# EAGLE design ESP32 UWB v1.0 (EAGLE 6.1)
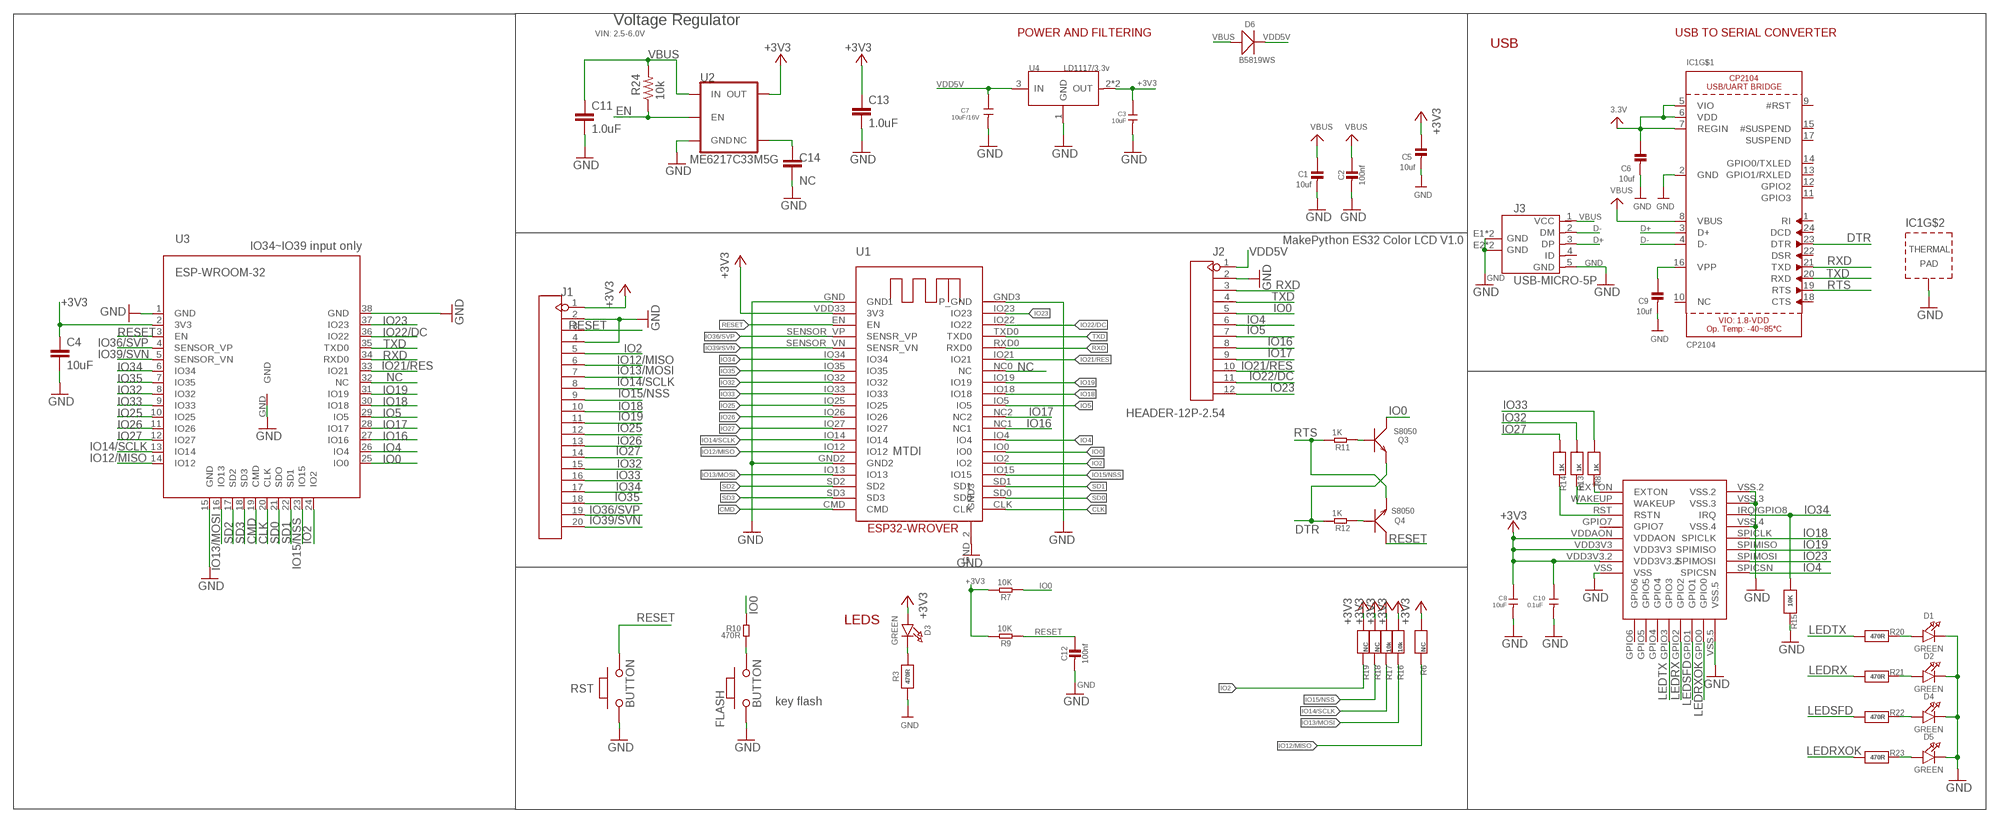
[diagram p0: schematic, sheet 1]

## Parts
C1  10uf  CAP_CERAMIC0603_NO  [0603-NO]
C2  100nf  CAP_CERAMIC0603_NO  [0603-NO]
C3  10uF  C-0603  [C0603]
C4  10uF  C-EUC0603  [C0603]
C5  10uf  CAP_CERAMIC0603_NO  [0603-NO]
C6  10uf  CAP_CERAMIC0603_NO  [0603-NO]
C7  10uF/16V  C-0603  [C0603]
C8  10uF  C-0603  [C0603]
C9  10uf  CAP_CERAMIC0603_NO  [0603-NO]
C10  0.1uF  C-0603  [C0603]
C11  1.0uF  1.0UF-0603-16V-10%  [0603]
C12  100nf  CAP_CERAMIC0603_NO  [0603-NO]
C13  1.0uF  1.0UF-0603-16V-10%  [0603]
C14  NC  1.0UF-0603-16V-10%  [0603]
D1  GREEN  LED0805_NOOUTLINE  [CHIPLED_0805_NOOUTLINE]
D2  GREEN  LED0805_NOOUTLINE  [CHIPLED_0805_NOOUTLINE]
D3  GREEN  LED0805_NOOUTLINE  [CHIPLED_0805_NOOUTLINE]
D4  GREEN  LED0805_NOOUTLINE  [CHIPLED_0805_NOOUTLINE]
D5  GREEN  LED0805_NOOUTLINE  [CHIPLED_0805_NOOUTLINE]
D6  B5819WS  D'0805'  [SOD323]
FLASH  BUTTON  PB157  [157SW]
IC1  CP2104  [QFN24_4MM_SMSC]
J1  HEADER-20P-2.54  [20P-2.54]
J2  HEADER-12P-2.54  [12P-2.54]
J3  USB-MICRO-5P  [MICRO-USB-5P]
Q3  S8050  TRANSISTOR-NPN-SOT23  [SOT23]
Q4  S8050  TRANSISTOR-NPN-SOT23  [SOT23]
R3  470R  RESISTOR_0603_NOOUT  [0603-NO]
R6  NC  RESISTOR_0603_NOOUT  [0603-NO]
R7  10K  R-0603  [0603]
R8  1K  RESISTOR_0603_NOOUT  [0603-NO]
R9  10K  R-0603  [0603]
R10  470R  R-0603  [0603]
R11  1K  R-0603  [0603]
R12  1K  R-0603  [0603]
R13  1K  RESISTOR_0603_NOOUT  [0603-NO]
R14  1K  RESISTOR_0603_NOOUT  [0603-NO]
R15  10K  RESISTOR_0603_NOOUT  [0603-NO]
R16  10k  RESISTOR_0603_NOOUT  [0603-NO]
R17  10k  RESISTOR_0603_NOOUT  [0603-NO]
R18  NC  RESISTOR_0603_NOOUT  [0603-NO]
R19  NC  RESISTOR_0603_NOOUT  [0603-NO]
R20  470R  RESISTOR_0603_NOOUT  [0603-NO]
R21  470R  RESISTOR_0603_NOOUT  [0603-NO]
R22  470R  RESISTOR_0603_NOOUT  [0603-NO]
R23  470R  RESISTOR_0603_NOOUT  [0603-NO]
R24  10k  10KOHM-0603-1/10W-1%  [0603]
RST  BUTTON  PB157  [157SW]
U1  ESP32-WROVER  [ESP32-WROVER]
U2  ME6217C33M5G  V_REG_AP2112K-3.3V  [SOT23-5]
U3  ESP-WROOM-32  [ESP-WROOM-32]
U4  LD1117/3.3v  LD1117'SOT89'  [SOT89]
U5  DWM1000  [DWM1000]

## Nets
+3V3: C3.1 C4.1 C5.1 C6.1 C8.1 C10.1 C13.1 D3.A IC1.5(VIO) IC1.6(VDD) IC1.7(REGIN) J1.1 R6.1 R7.2 R9.2 R16.1 R17.1 R18.1 R19.1 U1.VDD33(3V3) U2.5(OUT) U3.2(3V3) U4.2(OUT) U4.4(OUT) U5.VDD3V3 U5.VDD3V3.2 U5.VDDAON ; supply symbol labelled 3.3V
CLK: U1.CLK U3.20(CLK)
CMD: U1.CMD U3.19(CMD)
D+: IC1.3(D+) J3.3(DP)
D-: IC1.4(D-) J3.2(DM)
DTR: IC1.23(DTR) Q3.2(E) R12.2
EN: R24.1 U2.3(EN)
GND: C1.2 C2.2 C3.2 C4.2 C5.2 C6.2 C7.2 C8.2 C9.2 C10.2 C11.2 C12.2 C13.2 C14.2 D1.C D2.C D4.C D5.C FLASH.1 IC1.2(GND) IC1.THERM(TP) J1.2 J1.4 J2.2 J3.5(GND) J3.E1(GND) J3.E2(GND) J3.P1(GND) J3.P2(GND) R3.1 R15.2 RST.1 U1.GND2 U1.GND3(P_GND) U1.GND(GND1) U1.GND_2(GND3) U2.2(GND) U3.1(GND) U3.15(GND) U3.38(GND) U3.GND U4.1(GND) U5.VSS U5.VSS.2 U5.VSS.3 U5.VSS.4 U5.VSS.5
IO0: J2.5 Q3.3(C) R7.1 R10.2 U1.IO0 U3.25(IO0)
IO2: J1.5 R19.2 U1.IO2 U3.24(IO2)
IO4: J2.6 U1.IO4 U3.26(IO4) U5.SPICSN
IO5: J2.7 U1.IO5 U3.29(IO5)
IO12/MISO: J1.6 R6.2 U1.IO12 U3.14(IO12)
IO13/MOSI: J1.7 R16.2 U1.IO13 U3.16(IO13)
IO14/SCLK: J1.8 R17.2 U1.IO14 U3.13(IO14)
IO15/NSS: J1.9 R18.2 U1.IO15 U3.23(IO15)
IO16: J2.8 U1.NC1 U3.27(IO16)
IO17: J2.9 U1.NC2 U3.28(IO17)
IO18: J1.10 U1.IO18 U3.30(IO18) U5.SPICLK
IO19: J1.11 U1.IO19 U3.31(IO19) U5.SPIMISO
IO21/RES: J2.10 U1.IO21 U3.33(IO21)
IO22/DC: J2.11 U1.IO22 U3.36(IO22)
IO23: J2.12 U1.IO23 U3.37(IO23) U5.SPIMOSI
IO25: J1.12 U1.IO25 U3.10(IO25)
IO26: J1.13 U1.IO26 U3.11(IO26)
IO27: J1.14 R14.1 U1.IO27 U3.12(IO27)
IO32: J1.15 R13.1 U1.IO32 U3.8(IO32)
IO33: J1.16 R8.1 U1.IO33 U3.9(IO33)
IO34: J1.17 R15.1 U1.IO34 U3.6(IO34) U5.IRQ/GPIO8(IRQ)
IO35: J1.18 U1.IO35 U3.7(IO35)
IO36/SVP: J1.19 U1.SENSOR_VP(SENSR_VP) U3.4(SENSOR_VP)
IO39/SVN: J1.20 U1.SENSOR_VN(SENSR_VN) U3.5(SENSOR_VN)
LEDRX: R21.1 U5.GPIO2
LEDRXOK: R23.1 U5.GPIO0
LEDSFD: R22.1 U5.GPIO1
LEDTX: R20.1 U5.GPIO3
N$1: D1.A R20.2
N$2: C9.1 IC1.16(VPP)
N$3: C14.1 U2.4(NC)
N$5: D3.C R3.2
N$10: R8.2 U5.EXTON
N$11: R13.2 U5.WAKEUP
N$12: R14.2 U5.RST(RSTN)
N$13: Q4.1(B) R12.1
N$14: Q3.1(B) R11.1
N$15: FLASH.2 R10.1
N$16: D2.A R21.2
N$17: D4.A R22.2
N$18: D5.A R23.2
NC: U1.NC0(NC) U3.32(NC)
RESET: C12.1 J1.3 Q4.3(C) R9.1 RST.2 U1.EN U3.3(EN)
RTS: IC1.19(RTS) Q4.2(E) R11.2
RXD: IC1.21(TXD) J2.3 U1.RXD0 U3.34(RXD0)
SD0: U1.SD0 U3.21(SDO)
SD1: U1.SD1 U3.22(SD1)
SD2: U1.SD2 U3.17(SD2)
SD3: U1.SD3 U3.18(SD3)
TXD: IC1.20(RXD) J2.4 U1.TXD0 U3.35(TXD0)
VBUS: C1.1 C2.1 C11.1 D6.+ IC1.8(VBUS) J3.1(VCC) R24.2 U2.1(IN)
VDD5V: C7.1 D6.- J2.1 U4.3(IN)
Unconnected: IC1.1(RI) IC1.9(#RST) IC1.10(NC) IC1.11(GPIO3) IC1.12(GPIO2) IC1.13(GPIO1/RXLED) IC1.14(GPIO0/TXLED) IC1.15(#SUSPEND) IC1.17(SUSPEND) IC1.18(CTS) IC1.22(DSR) IC1.24(DCD) J3.4(ID) U5.GPIO4 U5.GPIO5 U5.GPIO6 U5.GPIO7

## Notes on the sheet
- Voltage Regulator
- VIN: 2.5-6.0V | POWER AND FILTERING | USB TO SERIAL CONVERTER
- USB
- MakePython ES32 Color LCD V1.0
- IO34~IO39 input only
- MTDI
- LEDS
- key flash

## Library data of the parts
C1 C2 C5 C6 C9 C12 = microbuilder:CAP_CERAMIC: Ceramic Capacitors For new designs, use the packages preceded by an '_' character since they are more reliable: The following footprints should be used on most boards: _0402 - Standard footprint for regular board layouts _0603 - Standard footprint for regular board layouts _0805 - Standard footprint for regular board layouts _1206 - Standard footprint for regular board layouts For extremely tight-pitch boards where space is at a premium, the following 'micro-pitch' footprints can be used (smaller pads, no silkscreen outline, etc.): _0402MP - Micro-pitch footprint for very dense/compact boards _0603MP - Micro-pitch footprint for very dense/compact boards _0805MP - Micro-pitch footprint for very dense/compact boards _1206MP - Micro-pitch footprint for very dense/compact boards
C3 C7 C8 C10 = Discrete:C*: Ceramic Capacitors
C4 = rcl:C-EU: CAPACITOR, European symbol
C11 C13 = SparkFun-Capacitors:1.0UF: 1µF ceramic capacitors A capacitor is a passive two-terminal electrical component used to store electrical energy temporarily in an electric field.; PROD_ID: CAP-00868
C14 = SparkFun-Capacitors:1.0UF: 1µF ceramic capacitors A capacitor is a passive two-terminal electrical component used to store electrical energy temporarily in an electric field.; PROD_ID: CAP-00868; VALUE: 1.0uF
D1-D5 = microbuilder:LED: LED 0603 - 0603 Surface Mount Package 2mA: Green LED - Low Power (3.9mcd, 2ma, 1.7Vf) - Digikey: 475-2709-2-ND Orange LED - Low Power (9.8mcd, 2ma, 1.8Vf) - Digikey: 475-1194-2-ND Red LED - Low Power (5mcd, 2ma, 1.8Vf) - Digikey: 475-1195-2-ND Yellow LED - Low Power (7mcd, 2ma, 1.8Vf) - Digikey: 475-1196-2-ND 5mA: Blue LED - Low Power (17mcd, 5ma, 2.9Vf) - Digikey: LNJ937W8CRACT-ND 0805 - 0805 Surface Mount Package 2mA: Red LED (8.8mcd, 2mA, 1.8Vf, Clear) - Low Power [Digikey: 475-2510-1-ND] Green LED (5mcd, 2mA, 1.8Vf, Clear) - Low Power [Digikey: 475-2730-1-ND] Yellow LED (11.3mcd, 2mA, 1.8Vf, Clear) - Low Power [Digikey: 475-2555-1-ND] 20mA: Red LED (104mcd, 20mA, Diffused) - LS R976 [Digikey: 475-1278-6-ND] Red LED (12mcd, 20mA, 2.0Vf, Clear) - APT2012EC [Digikey: 754-1128-1-ND] Green LED (15mcd, 20mA, 2.2Vf, Clear) - APT2012GC [Digikey: 754-1131-1-ND] Orange LED (160mcd, 20mA, 2.1Vf, Clear) - APT2012SECK [Digikey: 754-1130-1-ND] 1206 - 1206 Surface Mount Package Green LED (26mcd, 20mA, Diffused) - LG N971 [Digikey: 475-1407-6-ND] Red LED (15mcd, 20mA, Diffused) - LH N974 [Digikey: 475-1416-6-ND] Cree - Cree High-Power Surface Mount LEDs XPEBWT-L1-0000-00D50 - White 111lm 350mA 2.9Vf 6200K 110° XTEAWT-00-0000-00000LEE3 - White 114lm 350mA 2.85Vf 5000K 115° Everlight - Everlight 45-21 Series Surface Mount LEDs 45-21/QK2C-B2832AC2CB2/2T - Warm White 2000mcd 20mA 3.25Vf 3050K 120° 45-21/LK2C-B38452C4CB2/2T - Nuetral White 2000mcd 20mA 3.25Vf 4150K 120° 45-21/LK2C-B50634C6CB2/2T - Cold White 2200mcd 20mA 3.25Vf 5650K 120° PLCC2 Reverse Mount LS T77K-J1L2-1-0-2-R18-Z - Red 11.25mcd 2mA 1.8Vf 630nm 120° LO T77K-L1M2-24-Z - Orange 19.6mcd 2mA 1.8Vf 606nm 120° LY T77K-K2M1-26-Z - Yellow 15.7mcd 2mA 1.8Vf 587nm 120°
D6 = Discrete:D*
FLASH RST = MySMD:PB157
IC1 = microbuilder:CP2104: CP2104 - USB to UART Bridge VDD Output: 3.45V
J1 = Connector:HEADER-20P
J2 = Connector:HEADER-12P
J3 = Connector:USB-MICRO-5P
Q3 Q4 = Discrete:TRANSISTOR-NPN*: NPN audion
R3 R6 R8 R13-R23 = microbuilder:RESISTOR: Resistors For new designs, use the packages preceded by an '_' character since they are more reliable: The following footprints should be used on most boards: _0402 - Standard footprint for regular board layouts _0603 - Standard footprint for regular board layouts _0805 - Standard footprint for regular board layouts _1206 - Standard footprint for regular board layouts For extremely tight-pitch boards where space is at a premium, the following 'micro-pitch' footprints can be used (smaller pads, no silkscreen outline, etc.): _0402MP - Micro-pitch footprint for very dense/compact boards _0603MP - Micro-pitch footprint for very dense/compact boards _0805MP - Micro-pitch footprint for very dense/compact boards _1206MP - Micro-pitch footprint for very dense/compact boards
R7 R9-R12 = Discrete:R*
R24 = SparkFun-Resistors:10KOHM: 10kΩ resistor A resistor is a passive two-terminal electrical component that implements electrical resistance as a circuit element. Resistors act to reduce current flow, and, at the same time, act to lower voltage levels within circuits. - Wikipedia; PROD_ID: RES-00824
U1 = ESP32-Wrover:ESP32-WROVER
U2 = SparkFun-IC-Power:V_REG_AP2112: AP2112 - 600mA CMOS LDO Regulator w/ Enable The AP2112 is CMOS process low dropout linear regulator with enable function, the regulator delivers a guaranteed 600mA (min.) continuous load current. Features Output Voltage Accuracy: ±1.5% Output Current: 600mA (Min.) Foldback Short Current Protection: 50mA Enable Function to Turn ON/OFF VOUT Low Dropout Voltage (3.3V): 250mV (Typ.) @IOUT=600mA Excellent Load Regulation: 0.2%/A (Typ.) Excellent Line Regulation: 0.02%/V (Typ.) Low Quiescent Current: 55μA (Typ.) Low Standby Current: 0.01μA (Typ.) Low Output Noise: 50μVRMS PSRR: 100Hz -65dB, 1kHz -65dB OTSD Protection Stable with 1.0μF Flexible Cap: Ceramic, Tantalum and Aluminum Electrolytic Operation Temperature Range: -40°C to 85°C ESD: MM 400V, HBM 4000V; PROD_ID: VREG-12457; VALUE: 3.3V
U3 = esp32:ESP-WROOM-32
U4 = IC:LD1117: Low Drop Fixed And Adjustable Positive Voltage Regulators http://www.datasheetcatalog.org/datasheet/SGSThomsonMicroelectronics/mXuqtqv.pdf
U5 = DWM1000:DWM1000

## Net classes
0 default: width 0.203 mm, drill 0.305 mm, clearance 0.152 mm

## Board
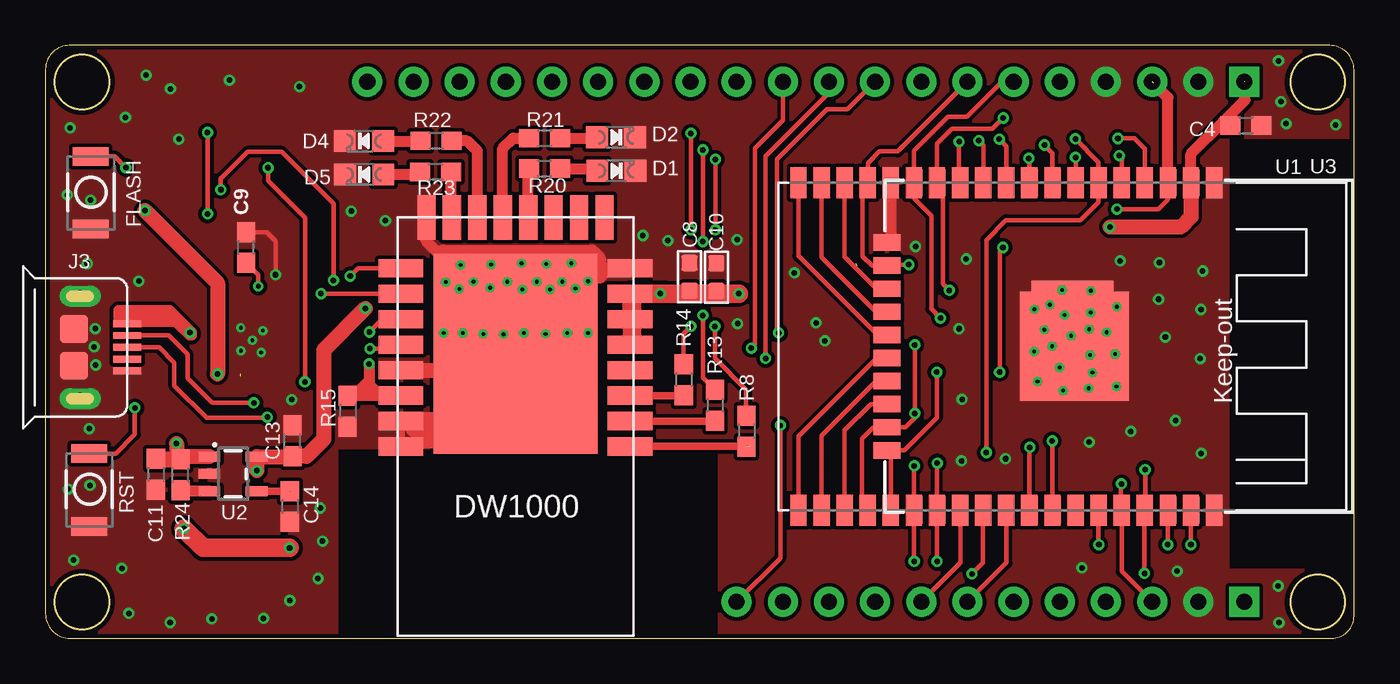
[diagram p1: board, top side]
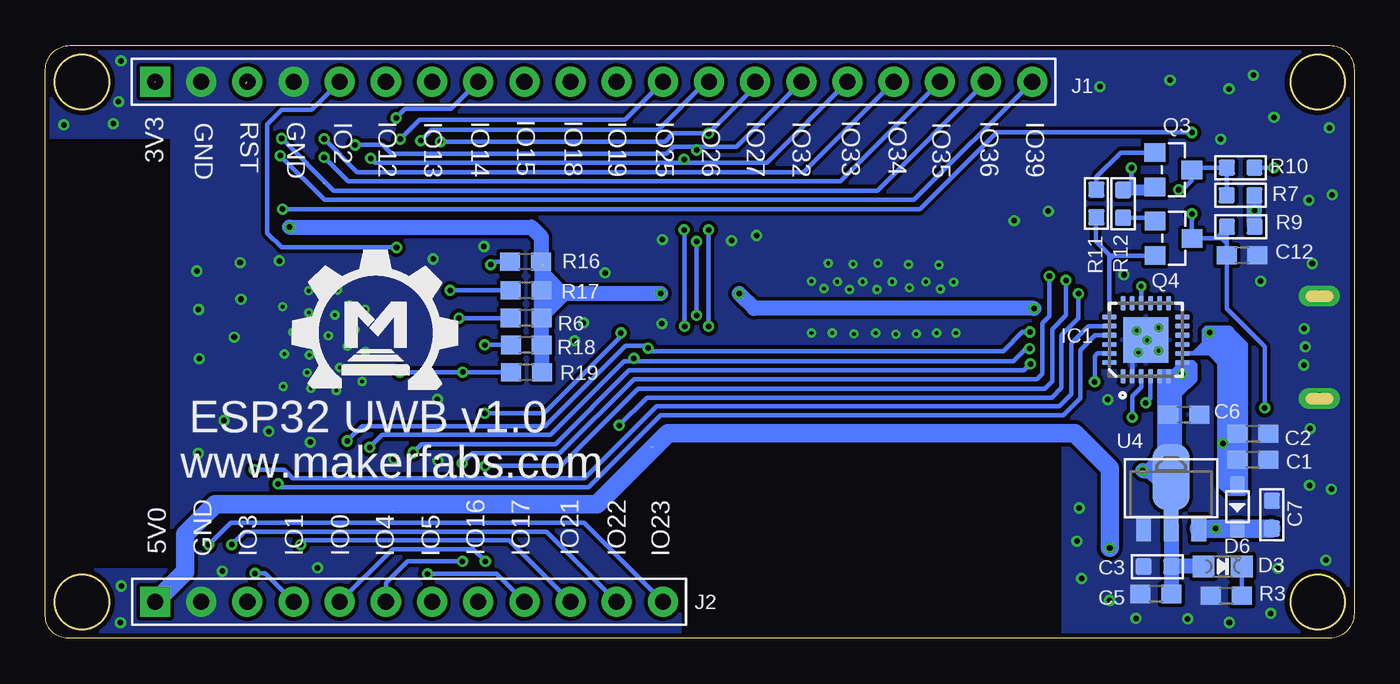
[diagram p2: board, bottom side, seen from below]

Size 72 x 32.6 mm. Coordinates in mm from the lower left corner, seen from the top.
Outline: 1.35,0 70.78,0 arc90 72,1.22 72,31.26 arc90 70.66,32.6 1.32,32.6 arc90 0,31.28 0,1.35 arc90 1.35,0
Outline: circle at 2,2 radius 1.5
Outline: circle at 2,30.6 radius 1.5
Outline: circle at 70,30.6 radius 1.5
Outline: circle at 70,2 radius 1.5
Copper layers (1*16): Top 0.035mm / dielectric 1.5mm / Bottom 0.035mm
Design rules: minimum track width 10mil, minimum drill 8mil, track to track 8mil, track to pad 8mil, pad to pad 8mil, via to via 8mil, smd to smd 8mil, copper to edge 10mil, drill to drill 8mil, minimum pad ring 10mil, minimum via ring 6mil, stop-mask expansion 4mil, vias tented up to drill 100mil, thermal gap 0mil
tRestrict: area 65.2,3.9 to 72,27.4; area 16.1,0 to 37,10.4
bRestrict: area 65.2,3.9 to 72,27.4; area 16.1,0 to 37,10.4

### Footprints (pad centres in the part's own frame; a part is rotated, then mirrored left to right if it is on the bottom)
0603-NO = smd 1.1 x 1: 1 -0.85,0; 2 0.85,0
C0603 = smd 0.889 x 0.889: 1 -0.762,0; 2 0.762,0
C0603' = smd 1.1 x 1: 1 -0.85,0; 2 0.85,0
0603 = smd 1.1 x 1: 1 -0.85,0; 2 0.85,0
CHIPLED_0805_NOOUTLINE = smd 1.2 x 1.2: A 0,-1.05; C 0,1.05
SOD323 = smd 1 x 0.8: + -1.2,0; - 1.2,0
157SW = smd 1.016 x 1.981: 1 0,0; 2 4,0
QFN24_4MM_SMSC = smd 0.8 x 0.28: 1 -2,1.25; 2 -2,0.75; 3 -2,0.25; 4 -2,-0.25; 5 -2,-0.75; 6 -2,-1.25; 13 2,-1.25; 14 2,-0.75; 15 2,-0.25; 16 2,0.25; 17 2,0.75; 18 2,1.25 | smd 0.28 x 0.8: 7 -1.25,-2; 8 -0.75,-2; 9 -0.25,-2; 10 0.25,-2; 11 0.75,-2; 12 1.25,-2; 19 1.25,2; 20 0.75,2; 21 0.25,2; 22 -0.25,2; 23 -0.75,2; 24 -1.25,2 | smd 2.5 x 2.5: THERM 0,0
20P-2.54 = drill 0.889 pad 1.651 square: 1 -25.4,0 | drill 0.889 pad 1.651: 2 -22.86,0; 3 -20.32,0; 4 -17.78,0; 5 -15.24,0; 6 -12.7,0; 7 -10.16,0; 8 -7.62,0; 9 -5.08,0; 10 -2.54,0; 11 0,0; 12 2.54,0; 13 5.08,0; 14 7.62,0; 15 10.16,0; 16 12.7,0; 17 15.24,0; 18 17.78,0; 19 20.32,0; 20 22.86,0
12P-2.54 = drill 0.889 pad 1.651 square: 1 0,13.97 | drill 0.889 pad 1.651: 2 0,11.43; 3 0,8.89; 4 0,6.35; 5 0,3.81; 6 0,1.27; 7 0,-1.27; 8 0,-3.81; 9 0,-6.35; 10 0,-8.89; 11 0,-11.43; 12 0,-13.97
MICRO-USB-5P = smd 0.38 x 1.52: 1 -1.3,0; 2 -0.65,0; 3 0,0; 4 0.65,0; 5 1.3,0 | smd 1.524 x 1.524: E1 -1.016,-2.921; E2 1.016,-2.921 | drill 0.635 pad 1.143 long: P1 -2.819,-2.591; P2 2.819,-2.591
SOT23 = smd 1.016 x 1.143: 1 -0.95,-1.016; 2 0.95,-1.016; 3 0,1.016
0603' = smd 0.889 x 0.889: 1 -0.762,0; 2 0.762,0
ESP32-WROVER = smd 1.7 x 0.9: CLK 18,1.27; CMD 0,1.27; EN 0,21.59; GND 0,24.13; GND3 18,24.13; GND_2 0,6.35; IO0 18,7.62; IO2 18,6.35; IO4 18,8.89; IO5 18,12.7; IO12 0,7.62; IO13 0,5.08; IO14 0,8.89; IO15 18,5.08; IO18 18,13.97; IO19 18,15.24; IO21 18,17.78; IO22 18,21.59; IO23 18,22.86; IO25 0,12.7; IO26 0,11.43; IO27 0,10.16; IO32 0,15.24; IO33 0,13.97; IO34 0,17.78; IO35 0,16.51; NC0 18,16.51; NC1 18,10.16; NC2 18,11.43; RXD0 18,19.05; SD0 18,2.54; SD1 18,3.81; SD2 0,3.81; SD3 0,2.54; SENSOR_VN 0,19.05; SENSOR_VP 0,20.32; TXD0 18,20.32; VDD33 0,22.86 | smd 4.5 x 4.5: GND2 7.62,16.34
SOT23-5 = smd 0.55 x 1.2: 1 -0.95,-1.3; 2 0,-1.3; 3 0.95,-1.3; 4 0.95,1.3; 5 -0.95,1.3
ESP-WROOM-32 = smd 0.9 x 1.5: 1 7.7,9; 2 6.43,9; 3 5.16,9; 4 3.89,9; 5 2.62,9; 6 1.35,9; 7 0.08,9; 8 -1.19,9; 9 -2.46,9; 10 -3.73,9; 11 -5,9; 12 -6.27,9; 13 -7.54,9; 14 -8.81,9; 25 -8.81,-9; 26 -7.54,-9; 27 -6.27,-9; 28 -5,-9; 29 -3.73,-9; 30 -2.46,-9; 31 -1.19,-9; 32 0.08,-9; 33 1.35,-9; 34 2.62,-9; 35 3.89,-9; 36 5.16,-9; 37 6.43,-9; 38 7.7,-9 | smd 1.5 x 0.9: 15 -10.3,5.715; 16 -10.3,4.445; 17 -10.3,3.175; 18 -10.3,1.905; 19 -10.3,0.635; 20 -10.3,-0.635; 21 -10.3,-1.905; 22 -10.3,-3.175; 23 -10.3,-4.445; 24 -10.3,-5.715 | smd 6 x 6: GND 0,0
SOT89 = smd 0.8 x 1.4: 1 -1.524,-1.905; 3 1.524,-1.905 | smd 0.8 x 1.9: 2 0,-1.651 | smd 2.032 x 3.65: 4 0,0.94
DWM1000 = smd 2.45 x 1: EXTON -2.8,12.6; GPIO7 -2.8,8.4; IRQ/GPIO8 9.8,9.8; RST -2.8,9.8; SPICLK 9.8,7; SPICSN 9.8,2.8; SPIMISO 9.8,5.6; SPIMOSI 9.8,4.2; VDD3V3 -2.8,4.2; VDD3V3.2 -2.8,5.6; VDDAON -2.8,7; VSS -2.8,2.8; VSS.2 9.8,12.6; VSS.3 9.8,11.2; VSS.4 9.8,8.4; WAKEUP -2.8,11.2 | smd 9 x 11: GND 3.5,7.5 | smd 1 x 2.45: GPIO0 7,0; GPIO1 5.6,0; GPIO2 4.2,0; GPIO3 2.8,0; GPIO4 1.4,0; GPIO5 0,0; GPIO6 -1.4,0; VSS.5 8.4,0

### Placement (x,y rotation side)
C1  5.57,9.82 0 bottom
C2  5.57,11.25 0 bottom
C3  10.82,3.94 180 bottom
C4  10uF  [C0603']  66.05,28.2 0 top
C5  10.9,2.43 180 bottom
C6  9.37,12.29 0 bottom
C7  4.52,6.79 90 bottom
C8  35.44,19.88 90 top
C9  11.05,21.49 90 top
C10  36.91,19.86 90 top
C11  6.08,9.01 270 top
C12  6.16,21.06 0 bottom
C13  13.59,10.85 90 top
C14  13.45,7.24 270 top
D1  31.41,25.7 270 top
D2  31.39,27.55 270 top
D3  7.23,3.94 270 bottom
D4  17.52,27.34 90 top
D5  17.54,25.51 90 top
D6  6.42,7.23 270 bottom
FLASH  2.5,22.5 90 top
IC1  11.46,16.41 90 bottom
J1  40.57,30.6 0 bottom
J2  52,2 90 bottom
J3  4.5,16 270 top
Q3  9.94,25.76 270 bottom
Q4  9.93,21.99 270 bottom
R3  7.04,2.34 0 bottom
R6  45.55,17.61 180 bottom
R7  10K  [0603']  6.24,24.36 0 bottom
R8  38.57,11.38 270 top
R9  10K  [0603']  6.23,22.63 0 bottom
R10  470R  [0603']  6.24,25.88 180 bottom
R11  1K  [0603']  14.18,23.91 270 bottom
R12  1K  [0603']  12.71,23.89 90 bottom
R13  36.83,12.81 270 top
R14  35.12,14.22 270 top
R15  16.63,12.49 270 top
R16  45.57,20.71 180 bottom
R17  45.56,19.14 180 bottom
R18  45.54,16.13 180 bottom
R19  45.53,14.62 180 bottom
R20  27.45,25.83 0 top
R21  27.46,27.5 0 top
R22  21.5,27.36 180 top
R23  21.48,25.64 180 top
R24  7.44,8.99 90 top
RST  2.42,6.15 90 top
U1  40.16,25.04 270 top
U2  10.33,9.04 270 top
U3  56.6,16.05 0 top
U4  10.06,7.93 0 bottom
U5  29.36,23.14 180 top
U$1  [MAKERFABS_0.3]  57.95,13.73 0 bottom

### Tracks (layer width: path | path; a pad name or v marks a point on that pad's centre or on a via)
+3V3  (via drill 0.3)  (3 unrouted)
  Top 0.254: 64.89,28.32 64.81,28.41 | 34.01,18.87 34.09,18.95
  Top 0.406: U5.VDD3V3.2 U5.VDDAON
  Top 0.61: U3.2 63.03,26.64 64.81,28.41 65.99,29.6 65.99,30.59
  Top 0.813: U3.2 U1.VDD33 63.02,23.17 62.46,22.61 v58.57,22.61 | U5.VDD3V3.2 U5.VDD3V3 | C8.1 35.19,18.87 34.01,18.87 32.39,18.87 32.31,18.95 v33.83,18.95 | v38.15,18.95 37.06,18.95 C10.1 | v17.6,18.14 15.32,15.85 15.32,10.95 14.37,10 C13.1 13.58,9.99 U2.5 v11.63,9.23 v11.63,9.22 | v5.48,23.52 9.47,19.53 v9.47,14.53 | C4.1 65.02,28.2 64.89,28.32
  Top 1.016: 32.24,16.19 32.24,16.18 arc90 32.26,16.16 32.27,16.16 32.27,18.84 arc90 U5.VDD3V3 34.09,18.95 v38.15,18.95
  Bottom 0.254: U4.2 10.06,7.87 | 10.06,7.87 U4.4 | 10.17,7.77 10.06,7.87 | 9.46,15.06 IC1.7 9.46,14.55 v9.47,14.53 9.59,14.41 IC1.6 | IC1.6 arc90 IC1.6 | R9.2 | 44.59,19.25 R17.1 | IC1.6 IC1.5 | IC1.6 C6.1 | 10.59,14.68 9.96,14.68 9.73,14.91 9.73,15.16 8.87,15.16 8.74,15.04 8.74,14.22 9.58,13.39 9.58,10.34 10.54,10.34 11.38,9.5 11.38,8.94 10.95,8.51 10.95,9.88 10.72,10.11 10.72,14.55 9.75,14.55 9.6,14.71 9.6,14.96 9.63,14.99 9.14,14.99
  Bottom 0.61: C6.1 10.22,12.35 10.16,12.4 | 9.14,14.99 9.14,14.4 9.32,14.22 10.36,14.22 10.36,11.15 9.93,10.72 9.93,13.72 9.65,13.72 9.42,13.95
  Bottom 0.813: v58.57,22.61 45.26,22.61 44.73,22.07 R16.1 44.59,20.58 44.59,19.25 | v17.6,18.14 33.02,18.14 v33.83,18.95 | v38.15,18.95 44.51,18.95 R17.1 R6.1 44.69,17.6 R18.1 44.68,16.12 R19.1 | C6.1 10.22,9.02 U4.4 10.42,9.22 v11.63,9.22 | U4.2 C3.1 | C3.1 C5.1 | D3.A C3.1 | R9.2 v5.48,23.52 R7.2 | 43.51,18.92 44.68,17.75 44.68,20.07 | 44.68,20.47 44.68,20.07 | 44.68,20.07 43.54,18.92
CLK
  Top 0.254: U1.CLK 41.43,11.1 45.74,15.42 U3.20
CMD
  Top 0.254: U1.CMD 41.43,21.03 45.74,16.71 46.27,16.71 U3.19
D+  (via drill 0.3)
  Top 0.254: v12.21,12.16 12.16,12.11 8.86,12.11 7.09,13.88 7.09,15.16 6.25,16 J3.3
  Bottom 0.254: IC1.3 11.71,13.81 12.21,13.31 v12.21,12.16
D-  (via drill 0.3)
  Top 0.254: v11.46,12.94 9.16,12.94 7.82,14.29 7.82,15.61 6.77,16.65 J3.2
  Bottom 0.254: IC1.4 11.21,13.2 v11.46,12.94
DTR  (via drill 0.3)
  Top 0.254: v12.24,25.86 12.24,25.17 14.3,23.11 14.3,14.12 v14.28,14.1
  Bottom 0.254: Q3.2 11.12,24.65 | IC1.23 14.13,15.66 14.28,15.52 v14.28,14.1 | v12.24,25.88 v12.24,25.86 12.24,24.77 12.27,24.74 | 12.27,24.74 12.62,24.74 R12.2 12.43,24.65 12.39,24.69 12.32,24.69 12.27,24.74
  Bottom 0.61: 11.12,24.65 R12.2 11.93,24.65
EN
  Top 0.61: U2.3 7.3,8.09 R24.1
GND  (via drill 0.2, 0.3)
  Top 0.254: v29.85,19.63 29.85,19.74 30.43,20.32 | C9.2 12.18,22.34 12.68,21.84 12.68,20.02 | v12.65,19.99 v12.66,19.99 | v12.65,19.99 12.68,19.99 12.68,20.02 | 12.68,20.02 12.65,19.99 v12.65,19.99
  Top 0.406: U5.VSS.3 U5.VSS.2
  Top 0.61: U1.GND_2 46.51,21.97 arc-90 U3.15 46.37,21.76 arc90 46.47,21.87 46.47,21.81 | U5.VSS 22.45,20.34 20.95,21.84 U5.VSS.5
  Top 0.813: U5.VSS.4 22.77,14.74 23.62,13.89 23.62,12.42 23.14,11.94 19.57,11.94 U5.VSS.3 | 21.87,21.23 30.07,21.23 30.43,20.88 30.43,20.32 30.43,19.99 30.5,19.91 | 20.6,10.85 21.77,10.85 21.79,10.87 21.79,11.48 20.24,11.48 20.24,11.68 20.6,12.04 21.61,12.04
  Bottom 0.254: IC1.2 12.21,15.66 IC1.THERM
  other vias: 10.75,17.07 10.76,15.81 11.87,15.71 7.34,27.45 2.3,20.61 54.41,18.09 4.2,3.84 13.56,13.12 1.55,4.3 9.15,1.07 11.97,16.92 2.68,16.02 1.25,8.2 2.41,11.53 2.76,15.03 2.45,8.4 6.88,30.21 10.12,30.69 2.49,24.1 5.54,30.97 57.51,17.91 58.85,15.64 56.43,16.64 58.95,18.23 57.43,10.79 50.27,17.02 68.26,28.3 61.29,20.66 63.67,20.19 63.59,10.17 58.39,16.83 57.03,3.87 55.94,19.14 52.83,9.87 59.14,20.76 62.27,3.69 70.99,28.23 59.71,11.37 67.87,0.85 56.07,17.78 63.53,15.38 61.62,16.56 63.58,18.08 62.17,11.97 67.84,31.75 16.82,23.48 13.45,2.07 13.98,30.33 18.7,22.96 4.59,1.36 14.99,3.28 57.52,19.1 50.66,20.86 2.75,17.02 54.96,16.97 54.4,15.77 54.58,14.12 55.8,14.88 57.6,14.61 58.92,13.84 56,13.61 57.47,15.57 57.42,16.99 55.39,16.05 55.26,18.34 57.4,13.74 47.87,21.54 22.84,20.52 24.52,20.55 26.19,20.62 27.57,20.57 28.94,20.62 23.55,19.61 25.41,19.61 27.03,19.61 28.43,19.61 22.03,19.58 32.87,22.15 38.06,21.92 42.4,17.35 22.97,16.79 24.09,16.74 26.32,16.79 28.71,16.79 29.85,16.79 27.51,16.74 25.2,16.71 21.9,16.79 24.47,19.28 22.76,19.2 26.24,19.18 27.77,19.18 29.17,19.23 11.38,16.38 42.88,16.36 67.82,2.87 61.25,18.64 15.12,7.16 15.25,5.33 12,1.09 6.86,0.86 5.14,19.63 1.35,28.07 4.4,28.65 1.2,24.38 34.25,21.87 41.21,20.09 38.08,17.3 50.43,13.13 50.4,9.75 67.98,29.51
  pour Top: -8.51,37.36 75.44,37.36 75.44,-3.17 -8.52,-3.17 -8.52,37.36
  pour Bottom: -2.54,35.56 76.2,35.56 76.2,-2.54 -2.54,-2.54
IO0  (via drill 0.3)
  Top 0.254: v47.8,4.22 47.78,4.24 U1.IO0 U3.25 v47.79,9.46 v47.8,9.47 | v9.65,24.66 9.65,25.3 9.68,25.32 9.7,25.32 11.12,26.75 13.01,26.75 15.85,23.9 15.85,19.74 | 15.85,19.74 v15.85,19.68 15.85,19.71 15.8,19.76 15.82,19.76 15.85,19.74
  Bottom 0.254: R7.1 R10.2 8.8,25.88 Q3.3 8.93,25.19 9.45,24.66 v9.65,24.66 | v47.8,4.22 48.48,4.9 52.91,4.9 J2.5 | v15.85,19.68 15.85,17.75 16.61,16.99 16.61,14.12 17.02,13.72 39.4,13.72 43.64,9.47 v47.8,9.47
IO2  (via drill 0.3)
  Top 0.254: U1.IO2 46.51,10.12 U3.24 47.27,10.34 49.05,12.12 v49.05,14.63 | v52.5,14.63 52.5,21.31 v52.68,21.49
  Bottom 0.254: R19.2 v49.04,14.62 | v49.04,14.62 v49.05,14.63 | v49.04,14.62 v52.5,14.62 v52.5,14.63 | v52.68,21.49 59,21.49 59.79,22.28 59.79,28.27 59,29.06 57.35,29.06 J1.5
IO4  (via drill 0.3)
  Top 0.254: U1.IO4 U3.26 v49.06,4.23 v49.06,4.22 | U1.IO4 | U5.SPICSN 17.2,20.34 v16.76,19.91 | U1.IO4 49.05,9.61 v49.07,9.63
  Bottom 0.254: J2.6 53.26,3.05 52.09,4.22 v49.06,4.22 | v16.76,19.91 16.76,17.7 17.14,17.32 17.14,14.55 17.45,14.25 39.62,14.25 43.71,10.16 48.54,10.16 v49.07,9.63
IO5  (1 unrouted)
  Top 0.254: J2.7 52.87,4.14 U3.29
IO12/MISO  (via drill 0.3)  (1 unrouted)
  Top 0.254: U3.14 U1.IO12 47.78,26.8 49.66,28.68 50.7,28.68 52.62,30.6 J1.6 | U3.14 47.79,24.19 48.74,23.24 48.74,18.11 v49.25,17.6
  Bottom 0.254: R6.2 v49.24,17.61 v49.25,17.6
IO13/MOSI  (via drill 0.3)
  Top 0.254: J1.7 46.9,26.77 45.9,26.77 45.24,26.11 U1.IO13 44.96,24.76 44.96,21.01 45.49,20.47 46.28,20.47 U3.16 46.36,20.55 v47.5,20.55
  Bottom 0.254: R16.2 47.34,20.71 v47.5,20.55
IO14/SCLK  (via drill 0.3)
  Top 0.254: v49.73,19.13 49.38,19.48 49.38,24.73 U3.13 U1.IO14 49.05,27.18 49.89,28.02 52.11,28.02 v52.7,28.61
  Bottom 0.254: J1.8 49.68,29.11 52.2,29.11 v52.7,28.61 | v49.73,19.13 46.42,19.13 R17.2
IO15/NSS  (via drill 0.3)
  Top 0.254: U1.IO15 44.93,7.35 44.93,10.97 45.54,11.58 46.28,11.58 U3.23 47.31,11.6 47.83,12.12 v47.83,12.37 v47.83,16.13 | J1.9 44.13,29.08 43,29.08 40.26,26.34 40.26,16.87 v40.34,16.79
  Bottom 0.254: v47.83,16.13 R18.2 | v47.83,12.37 44.58,12.37 40.34,16.61 v40.34,16.79
IO16
  Top 0.254: U1.NC1 U3.27 50.33,4.14 J2.8
IO17  (via drill 0.3)
  Top 0.254: U3.28 U1.NC2 51.59,4.15 v50.98,3.54
  Bottom 0.254: J2.9 47.19,3.54 v50.98,3.54
IO18  (via drill 0.3)
  Top 0.254: U1.IO18 U3.30 54.14,10.48 v54.15,10.49 | U5.SPICLK 19.35,15.93 v17.86,15.93 | J1.10 43.11,30 39.62,26.52 v39.62,15.39
  Bottom 0.254: v17.86,15.93 18.06,15.93 18.75,15.24 39.65,15.24 | 39.65,15.24 40.16,15.24 44.22,11.18 53.47,11.18 v54.15,10.49 | v39.62,15.39 39.65,15.37 39.65,15.24
IO19  (via drill 0.3)
  Top 0.254: U3.31 U1.IO19 v55.4,10.84 v55.4,10.85 | U5.SPIMISO 19.52,17.5 18.49,17.5 v17.83,16.84 | J1.11 40.57,28.48 39.04,26.95 39.04,16.15 v38.84,15.95
  Bottom 0.254: v17.83,16.84 18.24,16.84 19.3,15.77 38.66,15.77 v38.84,15.95 38.96,16.08 40.08,16.08 44.5,11.66 54.59,11.66 v55.4,10.85
IO21/RES  (via drill 0.3)
  Top 0.254: U1.IO21 | U3.33 U1.IO21 | U1.IO21 57.94,5.16 v57.96,5.14
  Bottom 0.254: J2.10 46.49,5.38 57.72,5.38 v57.96,5.14
IO22/DC  (via drill 0.3)
  Top 0.254: U3.36 | U3.36 U1.IO22 | U3.36 v61.76,5.15 v61.75,5.14
  Bottom 0.254: J2.11 44.44,5.87 61.03,5.87 v61.75,5.14
IO23  (via drill 0.3)
  Top 0.254: U1.IO23 U3.37 63.03,5.15 v63.02,5.14 | J2.12 40.44,4.41 v40.44,11.71 | U5.SPIMOSI v15.17,18.95 v15.16,18.95
  Bottom 0.254: J2.12 42.38,6.35 61.81,6.35 v63.02,5.14 | v40.44,11.71 38.91,13.23 16.64,13.23 16.1,13.77 16.1,16.66 15.16,17.6 v15.16,18.95
IO25  (via drill 0.3)
  Top 0.254: U1.IO25 U3.10 | U3.10 | U3.10 52.87,27.06 v52.48,27.44
  Bottom 0.254: J1.12 40.11,28.52 51.4,28.52 v52.48,27.44
IO26  (via drill 0.3)  (1 unrouted)
  Top 0.254: U1.IO26 U3.11 | U3.11 | U3.11 51.6,27.12 v51.35,27.36
  Bottom 0.254: J1.13 35.64,30.6 38.28,27.96 50.75,27.96 v51.35,27.36
IO27  (via drill 0.3)
  Top 0.254: U3.12 U1.IO27 50.27,25.09 v50.27,27.3 | R14.1 35.12,16.75 v35.51,17.14 | v35.51,22.45 v35.51,27.76
  Bottom 0.254: v35.51,17.14 v35.51,22.45 | v50.27,27.3 37.92,27.3 37.47,27.76 v35.51,27.76 | v35.51,27.76 | J1.14 32.95,30.32 v35.51,27.76
IO32  (via drill 0.3)
  Top 0.254: U1.IO32 U3.8 55.41,26.68 v54.97,27.13 | v36.17,17.75 36.17,14.32 R13.1 | v36.17,21.82 v36.17,26.85
  Bottom 0.254: v36.17,17.75 v36.17,21.82 | 36.3,27.03 37.44,27.03 37.82,26.64 52.96,26.64 53.44,27.13 v54.97,27.13 | 36.3,27.03 33.98,27.03 J1.15 | v36.17,26.85 36.17,26.9 36.3,27.03
IO33  (via drill 0.3)
  Top 0.254: U1.IO33 U3.9 54.14,26.35 v54.1,26.39 | v36.83,17.14 36.83,15.39 38.56,13.66 38.56,12.24 R8.1 | v36.85,22.45 v36.85,26.34
  Bottom 0.254: 36.91,26.16 32.31,26.16 J1.16 | v36.83,17.14 36.83,22.43 v36.85,22.45 | v36.85,26.34 36.85,26.21 36.91,26.16 | 36.91,26.16 53.87,26.16 v54.1,26.39
IO34  (via drill 0.3)
  Top 0.254: U1.IO34 U3.6 | 57.94,25.06 U3.6 | 57.96,25.04 U3.6 | 57.94,25.06 57.94,26.19 v56.67,27.46 | 57.94,25.06 57.94,23.98 56.95,22.99 52.86,22.99 51.77,21.89 v51.77,10.21
  Top 0.61: U5.IRQ/GPIO8 17.83,13.35 | 17.83,13.35 R15.1 | v17.8,15.09 17.8,14.15 | 17.8,13.95 17.8,13.37 17.83,13.35 | 17.17,13.39 17.17,13.51 17.8,14.15 | 17.8,14.15 17.8,13.95 | 17.8,13.95 18.34,13.41
  Bottom 0.254: J1.17 30.3,25.63 54.84,25.63 v56.67,27.46 | v17.8,15.09 18.16,14.73 39.88,14.73 43.94,10.67 51.31,10.67 v51.77,10.21
IO35  (via drill 0.3)  (1 unrouted)
  Top 0.254: 56.64,25.09 U3.7 56.68,26.43 v56.67,26.44
  Bottom 0.254: J1.18 28.27,25.12 55.35,25.12 v56.67,26.44
IO36/SVP  (via drill 0.3)
  Top 0.254: U1.SENSOR_VP U3.4 60.49,26.91 59.92,27.48 v59,27.48
  Bottom 0.254: J1.19 26.24,24.61 56.13,24.61 v59,27.48
IO39/SVN  (via drill 0.3)  (1 unrouted)
  Top 0.254: U1.SENSOR_VN 59.21,26.41 v59.08,26.54
  Bottom 0.254: J1.20 24.2,24.11 56.64,24.11 v59.08,26.54
LEDRX
  Top 0.61: U5.GPIO2 25.16,26.94 25.73,27.51 R21.1
LEDRXOK
  Top 0.61: U5.GPIO0 22.33,23.18 R23.1
LEDSFD
  Top 0.61: U5.GPIO1 23.77,26.78 23.19,27.36 R22.1
LEDTX
  Top 0.61: U5.GPIO3 26.57,25.79 R20.1
N$1
  Top 0.61: R20.2 30.23,25.83 D1.A
N$2  (via drill 0.25)
  Top 0.254: v11.71,19.36 11.71,19.98 C9.1
  Bottom 0.254: IC1.16 v11.71,19.36
N$3  (1 unrouted)
  Top 0.406: U2.4 C14.1 13.46,8.11
N$5
  Bottom 0.254: R3.2 D3.C
N$10  (1 unrouted)
  Top 0.406: U5.EXTON 38.73,10.54 38.73,10.63
N$11
  Top 0.406: U5.WAKEUP 36.83,11.95 R13.2
N$12
  Top 0.406: U5.RST 35.12,13.35 R14.2
N$13
  Bottom 0.254: Q4.1 11.12,23.13 R12.1
N$14
  Bottom 0.254: Q3.1 12.84,26.71 14.17,25.38 R11.1
N$15  (via drill 0.3)
  Top 0.254: FLASH.2 3.8,26.5 v4.42,25.88
  Bottom 0.254: v4.42,25.88 R10.1
N$16
  Top 0.61: R21.2 30.29,27.5 D2.A
N$17
  Top 0.61: D4.A 20.64,27.34 R22.2
N$18
  Top 0.61: D5.A 20.49,25.51 R23.2
NC
  Top 0.254: U1.NC0 U3.32
RESET  (via drill 0.3)  (1 unrouted)
  Top 0.254: v4.92,12.67 4.92,11.21 3.87,10.15 RST.2 | U1.EN | U1.EN U3.3 61.77,25.04 | U1.EN 61.75,24.11 61.24,23.6 v58.95,23.6 | v8.91,27.81 v8.91,23.34
  Top 0.61: U3.3 61.76,29.73 60.97,30.51
  Bottom 0.254: v4.92,12.67 4.92,16.02 7.01,18.12 C12.1 7.01,21.87 | 7.01,21.87 7.01,22.61 R9.1 | 7.14,21.99 Q4.3 v8.91,23.34 | 7.14,21.99 7.01,21.87 | v8.91,27.81 19.66,27.81 23.88,23.6 v58.95,23.6 | 7.09,22.45 7.11,22.45 7.57,22 7.29,22 7.06,21.77 7.06,22.02 | 7.06,22.02 7.19,22.15 | 7.06,22.02 7.11,22.02 7.14,21.99
RTS
  Bottom 0.254: R11.2 14.2,23.12 14.2,21.84 13.46,21.1 | IC1.19 13.46,21.1 | Q4.2 13.26,21.04 | 13.26,21.04 13.4,21.04 13.46,21.1 | 13.44,20.83 13.23,21.03 13.25,21.03 13.26,21.04
RXD  (via drill 0.3)
  Top 0.254: U1.RXD0 U3.34 | U1.RXD0 59.21,3.68 J2.3 | U1.RXD0 59.18,7.07 59.18,8.46 v59.21,8.48
  Bottom 0.254: IC1.21 14.25,16.66 15.06,15.85 15.06,13.21 16,12.27 38.15,12.27 42.11,8.31 59.03,8.31 v59.21,8.48
SD0
  Top 0.254: U1.SD0 42.7,11.13 45.72,14.15 U3.21
SD1
  Top 0.254: U1.SD1 43.97,11.43 45.41,12.88 U3.22
SD2
  Top 0.254: U1.SD2 43.97,20.98 45.74,19.2 46.28,19.2 U3.17
SD3
  Top 0.254: U1.SD3 42.7,20.95 45.7,17.96 U3.18
TXD  (via drill 0.3)
  Top 0.254: v60.47,3.56 60.47,6.46 60.5,6.5 60.5,7.04 | v60.5,9.27 60.5,7.06 U3.35 60.5,7.04 | 60.5,7.04 U1.TXD0
  Bottom 0.254: J2.4 59.91,3.56 v60.47,3.56 | IC1.20 14.62,17.16 15.54,16.23 15.54,13.41 16.2,12.75 38.38,12.75 42.34,8.79 58.4,8.79 58.88,9.27 v60.5,9.27
VBUS  (via drill 0.3)
  Top 0.254: J3.1 7.46,17.3 v7.96,16.8 7.99,16.84 8.01,16.84 | 4.46,17.26 3.87,17.26 3.86,17.26 3.86,18.09 3.97,18.2 6.89,18.2 8.2,16.89 8.2,16.59 8.09,16.48 7.88,16.48 7.12,17.24 3.86,17.24 4.08,17.45 4.08,18 4.09,18.02 6.83,18.02 8.01,16.84 | 8.01,16.84 8.01,16.66 7.51,17.15 7.42,17.15 6.72,17.85 4.24,17.85 4.28,17.81 4.28,17.47 4.32,17.51 6.95,17.51 6.77,17.69 4.15,17.69 | C11.1 6.38,9.87 C1.1
  Top 0.813: R24.2 6.43,9.84 C1.1 7.42,9.82 R24.2 | v7.21,10.72 7.21,10.06 R24.2 | U2.1 7.59,9.99 R24.2
  Bottom 0.254: IC1.8 7.95,15.66 | 7.95,15.66 7.91,15.66 | D6.+ C1.1 | C1.1 C2.1 6.42,15.45 7.63,16.66 7.63,16.85 | 6.02,7.96 5.95,8.03 5.95,16.16 6.64,16.85 7.63,16.85 | 7.63,16.85 8.82,15.66 | 8.82,15.66 8.86,15.66 | 8.82,15.66 7.94,15.66 | 6.89,8.3 6.89,8.29 6.89,8.09 6.83,8.03 5.95,8.03 6.04,7.93 6.93,7.93 7.4,8.4 7.4,15.13 7.94,15.66 | 7.63,16.85 7.91,16.85 v7.96,16.8 7.96,16.85 8.27,16.54 | 8.27,16.54 8.27,16.04 | 8.27,16.54 8.27,16.93 8.13,17.06 6.84,17.06 6.54,16.76 6.93,16.76 6.93,16.75 | 7.94,15.66 7.95,15.66 | C1.1 6.42,9.92 v7.21,10.72
  Bottom 0.305: 7.41,16.41 7.88,16.41 8.47,15.82 8,15.82 7.99,15.81 7.99,16.05 8,16.06 7.66,16.06 7.22,16.51
  Bottom 0.813: 7.41,16.41 7.57,16.25 7.57,15.9 6.89,15.22 6.89,11 | 7.22,16.51 6.9,16.51 6.38,15.99 6.38,8.88 6.33,8.82 | 6.89,8.3 6.89,11 | 6.91,11.02 6.89,11
VDD5V  (via drill 0.3)  (1 unrouted)
  Top 1.016: v7.62,6.02 8.67,4.97 v13.44,4.97
  Bottom 0.254: C7.1 D6.- | v7.62,6.02 D6.- arc90 6.42,6.01
  Bottom 1.016: 4.59,6.05 arc90 4.56,6.02 4.56,6.01 4.54,6.01 arc-90 4.55,6.02 v7.62,6.02 U4.3 | J2.1 64.31,3.66 64.31,5.71 62.66,7.37 41.66,7.37 37.74,11.28 15.37,11.28 13.44,9.35 v13.44,4.97

### Text on the board
bPlace: IO34 | IO15 | IO39 | IO36 | IO35 | IO33 | IO32 | IO27 | IO26 | IO25 | IO19 | IO18 | IO14 | IO13 | IO12 | IO2 | GND | RST | GND | 3V3 | ESP32 UWB v1.0 | www.makerfabs.com | IO22 | IO21 | IO17 | IO16 | IO0 | IO1 | 5V0 | IO23 | IO5 | IO4 | IO3 | GND
tNames: U1